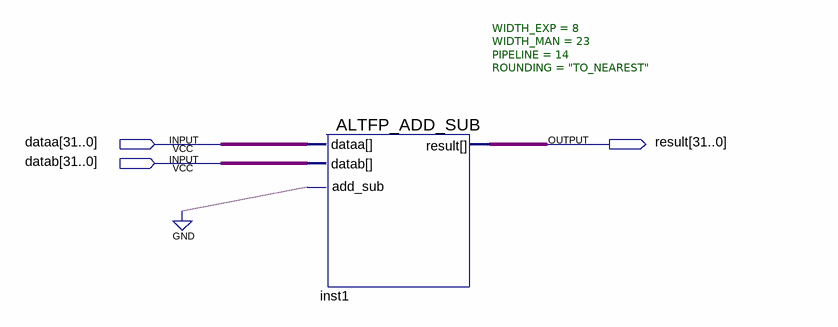
[diagram p0: schematic sheet]
// Quartus schematic custom_instr_fp_add.bdf as structural Verilog: 1 symbols, 3 pins
module custom_instr_fp_add (
  input  [31:0] dataa,
  input  [31:0] datab,
  output [31:0] result
);

  ALTFP_ADD_SUB #(.WIDTH_EXP(8), .WIDTH_MAN(23), .PIPELINE(14), .ROUNDING("TO_NEAREST")) inst1 (
    .add_sub(1'b0), .dataa(dataa), .datab(datab), .result(result));
endmodule
